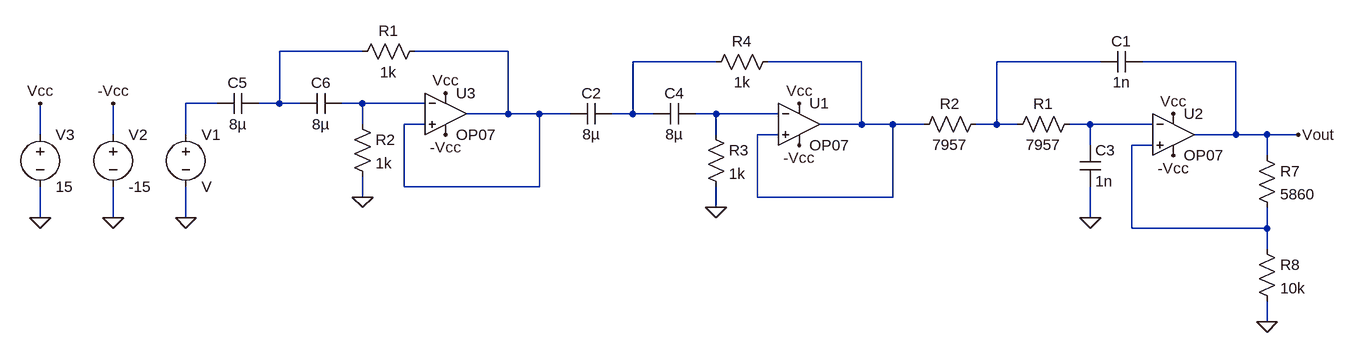
[diagram p0: schematic sallen_key_bandpass.asc]
sallen_key_bandpass.asc, the LTspice schematic file:
Version 4
SHEET 1 1044 680
WIRE -560 48 -688 48
WIRE -336 48 -480 48
WIRE -16 64 -144 64
WIRE 208 64 64 64
WIRE 576 64 416 64
WIRE 784 64 640 64
WIRE -784 128 -832 128
WIRE -688 128 -688 48
WIRE -688 128 -720 128
WIRE -656 128 -688 128
WIRE -560 128 -592 128
WIRE -464 128 -560 128
WIRE -336 144 -336 48
WIRE -336 144 -400 144
WIRE -288 144 -336 144
WIRE -240 144 -288 144
WIRE -144 144 -144 64
WIRE -144 144 -176 144
WIRE -112 144 -144 144
WIRE -16 144 -48 144
WIRE 80 144 -16 144
WIRE -560 160 -560 128
WIRE -464 160 -496 160
WIRE 208 160 208 64
WIRE 208 160 144 160
WIRE 256 160 208 160
WIRE 304 160 256 160
WIRE 416 160 416 64
WIRE 416 160 384 160
WIRE 448 160 416 160
WIRE 560 160 528 160
WIRE 656 160 560 160
WIRE -1056 176 -1056 128
WIRE -944 176 -944 128
WIRE -832 176 -832 128
WIRE -16 176 -16 144
WIRE 80 176 48 176
WIRE 784 176 784 64
WIRE 784 176 720 176
WIRE 832 176 784 176
WIRE 880 176 832 176
WIRE 560 192 560 160
WIRE 656 192 624 192
WIRE 832 208 832 176
WIRE -496 256 -496 160
WIRE -288 256 -288 144
WIRE -288 256 -496 256
WIRE -560 272 -560 240
WIRE 48 272 48 176
WIRE 256 272 256 160
WIRE 256 272 48 272
WIRE -16 288 -16 256
WIRE -1056 304 -1056 256
WIRE -944 304 -944 256
WIRE -832 304 -832 256
WIRE 560 304 560 256
WIRE 624 320 624 192
WIRE 832 320 832 288
WIRE 832 320 624 320
WIRE 832 352 832 320
WIRE 832 464 832 432
FLAG -16 288 0
FLAG -832 304 0
FLAG 832 464 0
FLAG 560 304 0
FLAG -1056 304 0
FLAG -944 304 0
FLAG -1056 128 Vcc
FLAG -944 128 -Vcc
FLAG 112 128 Vcc
FLAG 688 144 Vcc
FLAG 112 192 -Vcc
FLAG 688 208 -Vcc
FLAG -560 272 0
FLAG -432 112 Vcc
FLAG -432 176 -Vcc
FLAG 880 176 Vout
SYMBOL OpAmps\\OP07 112 96 R0
SYMATTR InstName U1
SYMBOL voltage -832 160 R0
SYMATTR InstName V1
SYMBOL OpAmps\\OP07 688 112 R0
SYMATTR InstName U2
SYMBOL res 816 192 R0
SYMATTR InstName R7
SYMATTR Value 5860
SYMBOL res 816 336 R0
SYMATTR InstName R8
SYMATTR Value 10k
SYMBOL cap 544 192 R0
SYMATTR InstName C3
SYMATTR Value 1n
SYMBOL voltage -944 160 R0
WINDOW 123 0 0 Left 0
WINDOW 39 0 0 Left 0
SYMATTR InstName V2
SYMATTR Value -15
SYMBOL voltage -1056 160 R0
WINDOW 123 0 0 Left 0
WINDOW 39 0 0 Left 0
SYMATTR InstName V3
SYMATTR Value 15
SYMBOL res 544 144 R90
WINDOW 0 0 56 VBottom 2
WINDOW 3 32 56 VTop 2
SYMATTR InstName R1
SYMATTR Value 7957
SYMBOL res 400 144 R90
WINDOW 0 0 56 VBottom 2
WINDOW 3 32 56 VTop 2
SYMATTR InstName R2
SYMATTR Value 7957
SYMBOL cap 640 48 R90
WINDOW 0 0 32 VBottom 2
WINDOW 3 32 32 VTop 2
SYMATTR InstName C1
SYMATTR Value 1n
SYMBOL cap -176 128 R90
WINDOW 0 0 32 VBottom 2
WINDOW 3 32 32 VTop 2
SYMATTR InstName C2
SYMATTR Value 8µ
SYMBOL cap -48 128 R90
WINDOW 0 0 32 VBottom 2
WINDOW 3 32 32 VTop 2
SYMATTR InstName C4
SYMATTR Value 8µ
SYMBOL res -32 160 R0
SYMATTR InstName R3
SYMATTR Value 1k
SYMBOL res 80 48 R90
WINDOW 0 0 56 VBottom 2
WINDOW 3 32 56 VTop 2
SYMATTR InstName R4
SYMATTR Value 1k
SYMBOL OpAmps\\OP07 -432 80 R0
SYMATTR InstName U3
SYMBOL cap -720 112 R90
WINDOW 0 0 32 VBottom 2
WINDOW 3 32 32 VTop 2
SYMATTR InstName C5
SYMATTR Value 8µ
SYMBOL cap -592 112 R90
WINDOW 0 0 32 VBottom 2
WINDOW 3 32 32 VTop 2
SYMATTR InstName C6
SYMATTR Value 8µ
SYMBOL res -576 144 R0
SYMATTR InstName R2
SYMATTR Value 1k
SYMBOL res -464 32 R90
WINDOW 0 0 56 VBottom 2
WINDOW 3 32 56 VTop 2
SYMATTR InstName R1
SYMATTR Value 1k

The netlist it stands for:
* sallen_key_bandpass.asc
XU1 N004 N008 Vcc -Vcc N004 LT1001  ; OP07, pins In+ In- V+ V- OUT
V1 N006 0 V
XU2 N010 N009 Vcc -Vcc Vout LT1001  ; OP07, pins In+ In- V+ V- OUT
R7 Vout N010 5860
R8 N010 0 10k
C3 N009 0 1n
V2 -Vcc 0 -15
V3 Vcc 0 15
R1 N009 N005 7957
R2 N005 N004 7957
C1 Vout N005 1n
C2 N003 N002 8µ
C4 N008 N003 8µ
R3 N008 0 1k
R4 N004 N003 1k
XU3 N002 N007 Vcc -Vcc N002 LT1001  ; OP07, pins In+ In- V+ V- OUT
C5 N001 N006 8µ
C6 N007 N001 8µ
R2 N007 0 1k
R1 N002 N001 1k
.lib LTC.lib
.backanno
.end